# EasyEDA schematic SCH_Lasercutter-Air-Control_2024-07-31.json
TITLE: Sheet_1; REV: 1.0; Date: 2024-05-01; Sheet: 1/1; Company: Small Batch Factory
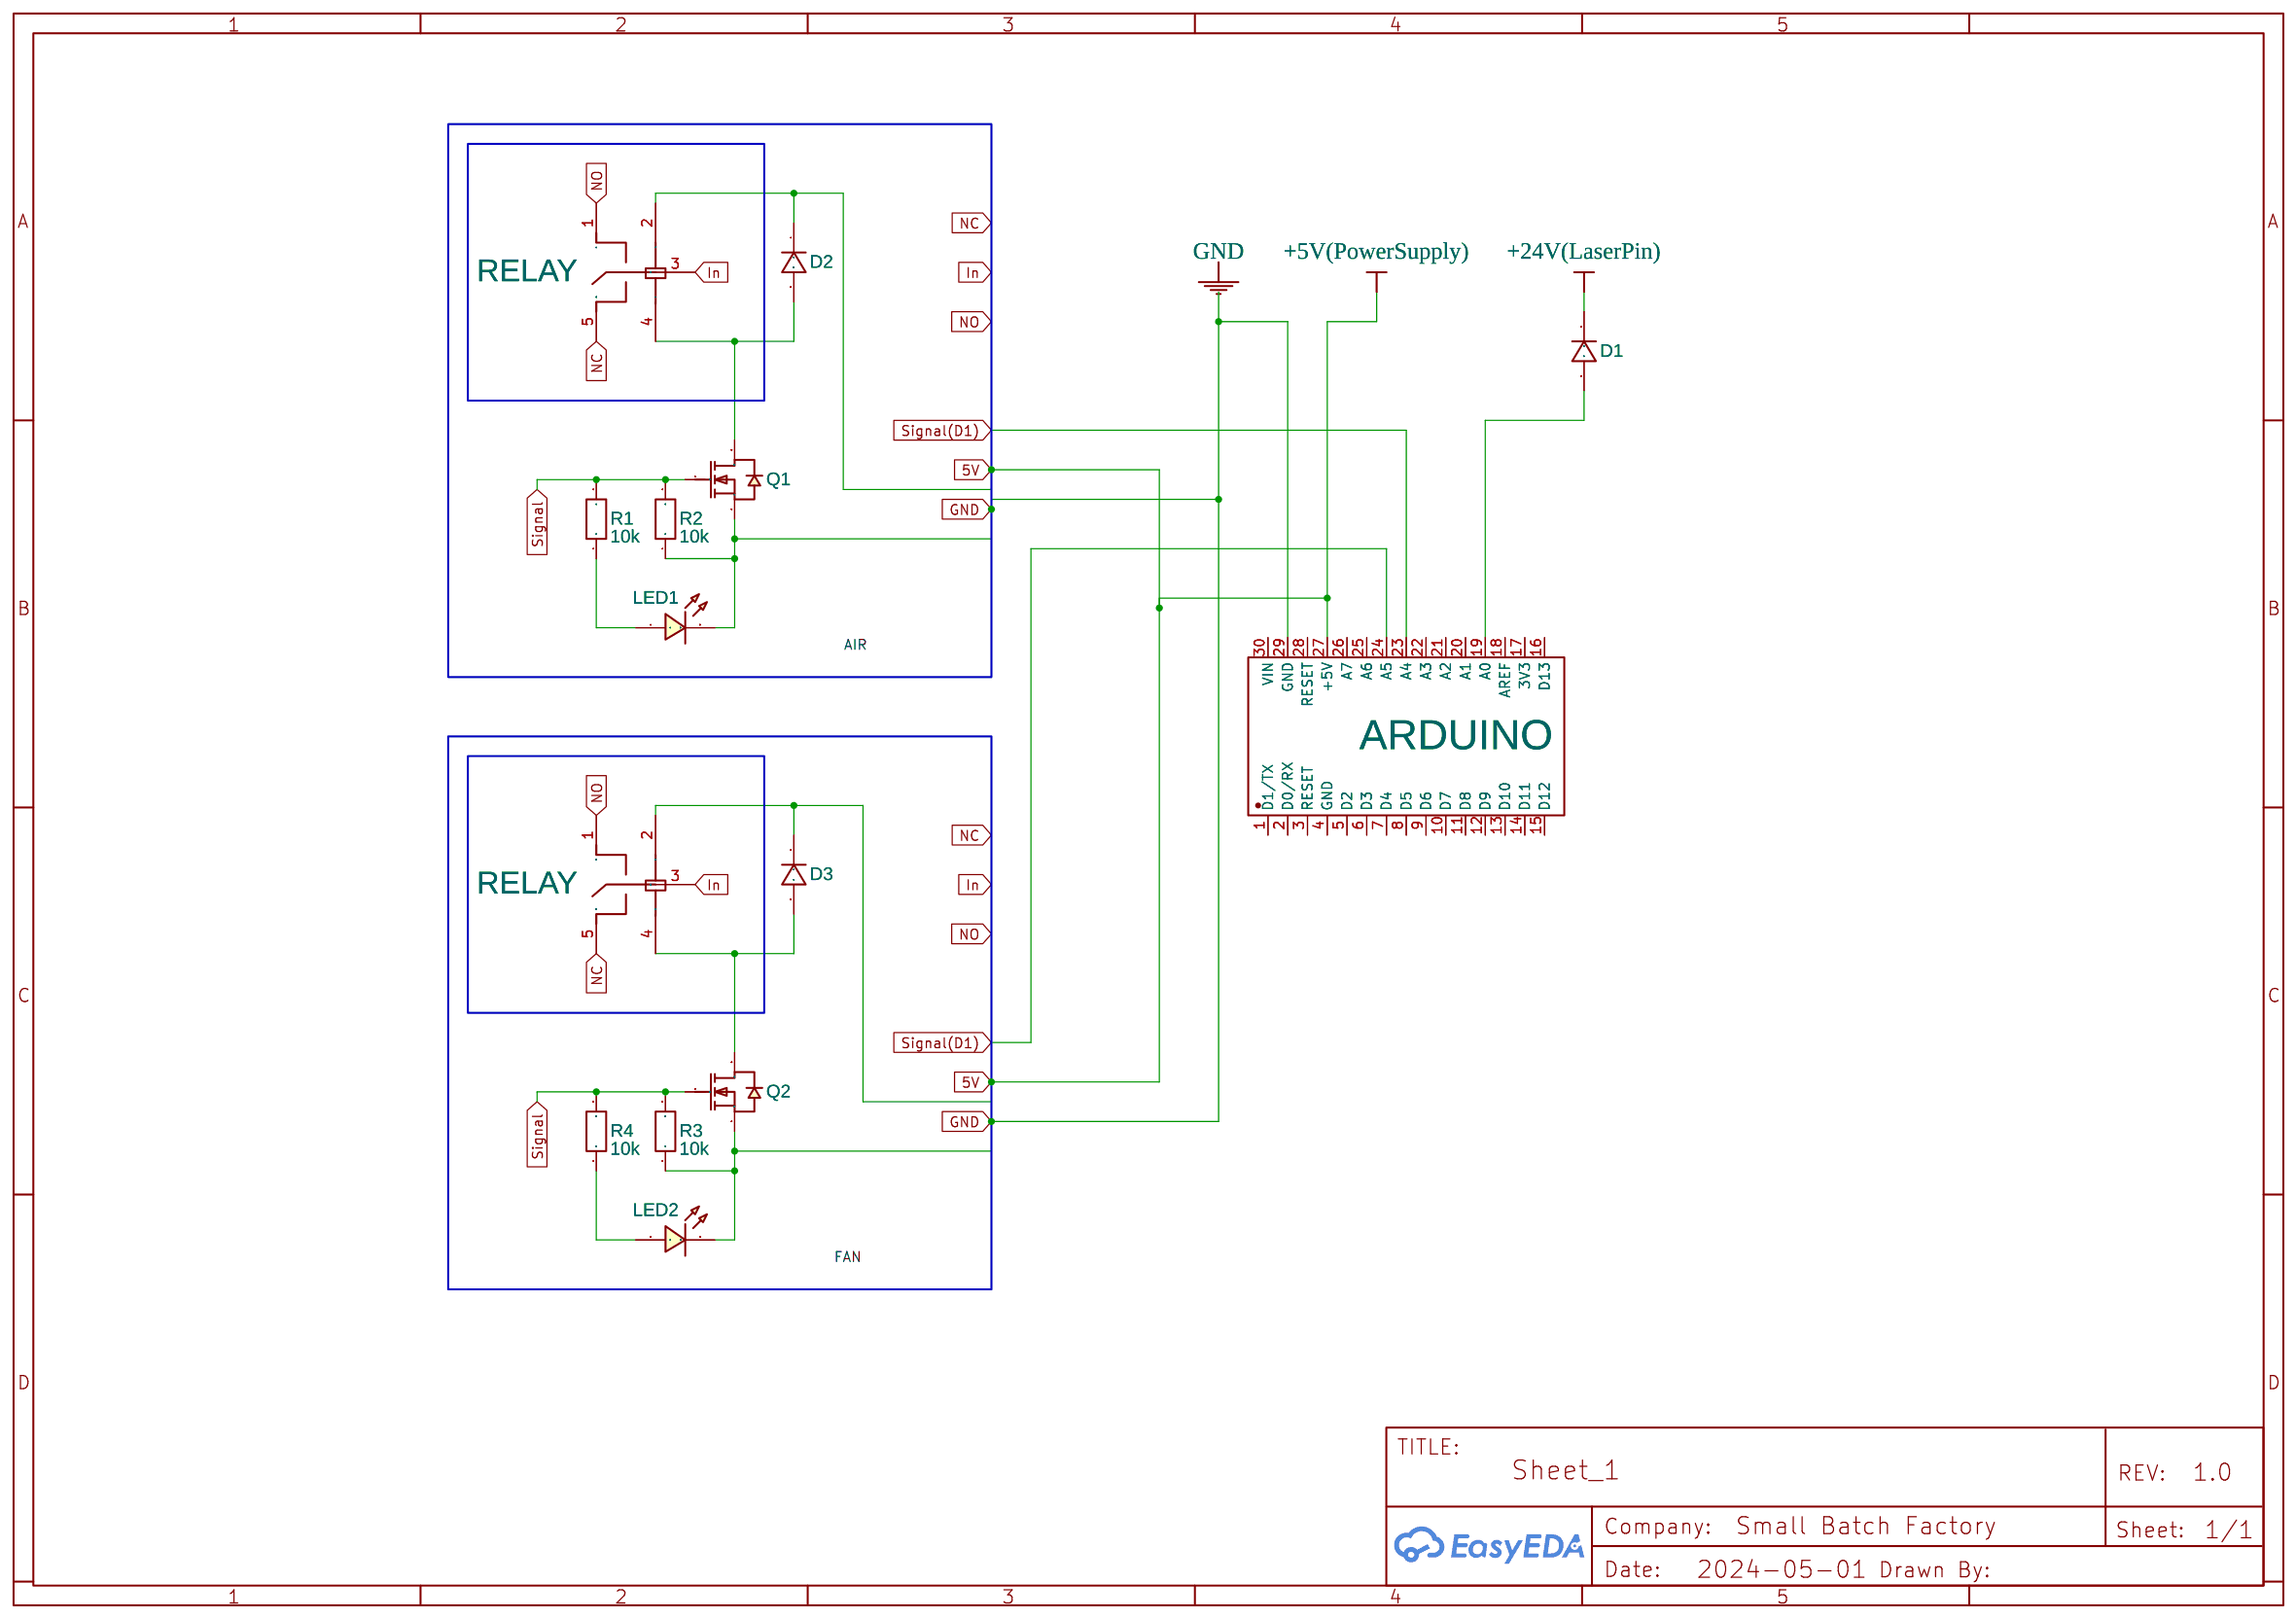
[diagram p0: schematic sheet]

## Parts
ARDUINO  ARDUINO_NANO  [COMM-TH_ARDUINO_NANO]
D1  1N4007W  [SOD-123_L2.8-W1.8-LS3.7-RD]
D2  1N4007W  [SOD-123_L2.8-W1.8-LS3.7-RD]
D3  1N4007W  [SOD-123_L2.8-W1.8-LS3.7-RD]
LED1  LED-0603_R  [LED0603_RED]
LED2  LED-0603_R  [LED0603_RED]
Q1  2N7002  [SOT-23_L2.9-W1.3-P0.95-LS2.4-BR]
Q2  2N7002  [SOT-23_L2.9-W1.3-P0.95-LS2.4-BR]
R1  10k  [R0603]
R2  10k  [R0603]
R3  10k  [R0603]
R4  10k  [R0603]
U2  RELAY  [RELAY-TH_RELAY-SPST]
U3  RELAY  [RELAY-TH_RELAY-SPST]

## Library data of the parts
ARDUINO = ARDUINO_NANO: Contributor: lcsc; Supplier: LCSC; Supplier Part: C9900017879; Manufacturer: null; JLCPCB Part Class: Extended Part
D1-D3 = 1N4007W: Supplier: LCSC; Supplier Part: C328592; Manufacturer: BLUE ROCKET; Contributor: LCEDA_Lib
LED1 LED2 = LED-0603_R: Manufacturer: EVERLIGHT(台湾亿光); Manufacturer Part: 19-217/R6C-AL1M2VY/3T; Supplier Part: C72044; Supplier: LCSC; Contributor: LCEDA_01
Q1 Q2 = 2N7002: Supplier: LCSC; Manufacturer: Nexperia; Manufacturer Part: 2N7002,215; image: //image.lceda.cn/szlcsc/C65189.jpg; Supplier Part: C65189; Paste Type: expand; Contributor: LCEDA_Lib
R1-R4 = R_0603_EU: Contributor: LCEDA_Lib
U2 U3 = RELAY-SPST: Contributor: LCSC; Supplier: LCSC; Supplier Part: C2941249; Manufacturer: null; Manufacturer Part: Relay-SPST

## Nets
+5V(PowerSupply): ARDUINO.27(+5V) D2.1 D3.1 U2.2 U3.2
+24V(LaserPin): D1.1
GND: ARDUINO.29(GND) LED1.2 LED2.2 Q1.2(S) Q2.2(S) R2.1 R3.1
In: U2.3 U3.3
NC: U2.5 U3.5
NO: U2.1 U3.1
Signal: Q1.1(G) Q2.1(G) R1.2 R2.2 R3.2 R4.2
Signal(D1): ARDUINO.23(A4) ARDUINO.24(A5)
Net-(ARDUINO-19): ARDUINO.19(A0) D1.2
Net-(D2-2): D2.2 Q1.3(D) U2.4
Net-(D3-2): D3.2 Q2.3(D) U3.4
Net-(LED1-1): LED1.1 R1.1
Net-(LED2-1): LED2.1 R4.1

Not connected (* = marked no-connect by the designer): ARDUINO 1(D1/TX) 2(D0/RX) 3(RESET) 4(GND) 5(D2) 6(D3) 7(D4) 8(D5) 9(D6) 10(D7) 11(D8) 12(D9) 13(D10) 14(D11) 15(D12) 16(D13) 17(3V3) 18(AREF) 20(A1) 21(A2) 22(A3) 25(A6) 26(A7) 28(RESET) 30(VIN)
